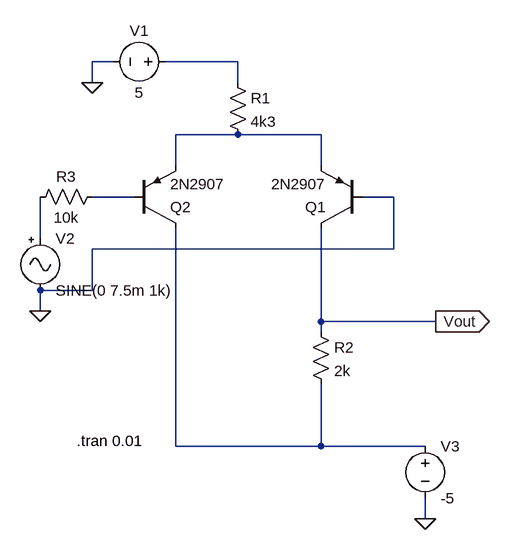
[diagram p0: schematic Draft8.asc]
Draft8.asc, the LTspice schematic file:
Version 4
SHEET 1 880 800
WIRE 160 80 128 80
WIRE 352 80 240 80
WIRE 128 112 128 80
WIRE 352 112 352 80
WIRE 352 192 256 192
WIRE 480 192 352 192
WIRE 256 240 256 192
WIRE 480 240 480 192
WIRE 192 288 128 288
WIRE 592 288 544 288
WIRE 48 352 48 288
WIRE 592 368 592 288
WIRE 592 368 128 368
WIRE 128 432 128 368
WIRE 128 432 48 432
WIRE 48 464 48 432
WIRE 480 480 480 336
WIRE 656 480 480 480
WIRE 480 496 480 480
WIRE 256 672 256 336
WIRE 480 672 480 576
WIRE 480 672 256 672
WIRE 640 672 480 672
WIRE 640 784 640 752
FLAG 640 784 0
FLAG 128 112 0
FLAG 656 480 Vout
IOPIN 656 480 Out
FLAG 48 464 0
SYMBOL voltage 256 80 R90
WINDOW 0 -32 56 VBottom 2
WINDOW 3 32 56 VTop 2
SYMATTR InstName V1
SYMATTR Value 5
SYMBOL res 336 96 R0
SYMATTR InstName R1
SYMATTR Value 4k3
SYMBOL pnp 544 336 R180
SYMATTR InstName Q1
SYMATTR Value 2N2907
SYMBOL pnp 192 336 M180
SYMATTR InstName Q2
SYMATTR Value 2N2907
SYMBOL Misc/signal 48 336 R0
SYMATTR InstName V2
SYMATTR Value SINE(0 7.5m 1k)
SYMBOL res 464 480 R0
SYMATTR InstName R2
SYMATTR Value 2k
SYMBOL voltage 640 656 R0
SYMATTR InstName V3
SYMATTR Value -5
SYMBOL res 144 272 R90
WINDOW 0 0 56 VBottom 2
WINDOW 3 32 56 VTop 2
SYMATTR InstName R3
SYMATTR Value 10k
TEXT 104 664 Left 2 !.tran 0.01

The netlist it stands for:
* Draft8.asc
V1 N001 0 5
R1 N001 N002 4k3
Q1 Vout 0 N002 0 2N2907
Q2 N005 N003 N002 0 2N2907
V2 N004 0 SINE(0 7.5m 1k)
R2 Vout N005 2k
V3 N005 0 -5
R3 N003 N004 10k
.model NPN NPN
.model PNP PNP
.lib standard.bjt
.tran 0.01
.backanno
.end